# Altium schematic sheet PokerKidtestBoard.SchDoc
size A4
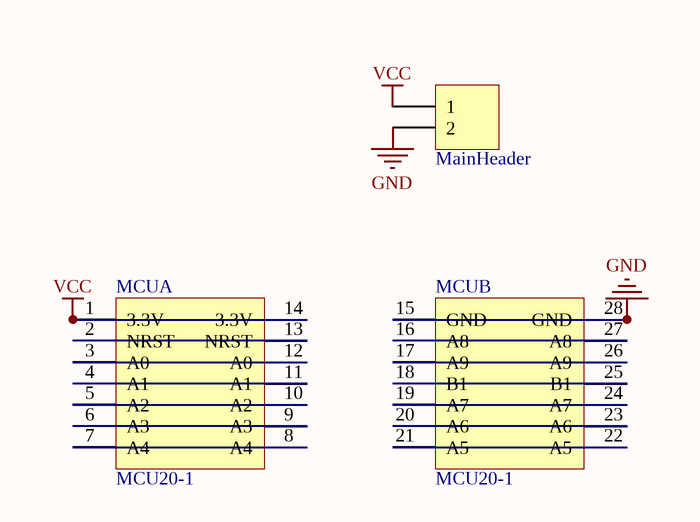
[diagram p0: PokerKidtestBoard.SchDoc]

## Parts
MainHeader  691312510002  [691312510002]  (value not drawn)
MCU  MCU20-1  [MCU20-1]  (parts A,B of 2)

## Nets
GND: MainHeader.2 MCU.15(GND) MCU.28(GND)
VCC: MainHeader.1 MCU.1(3.3V) MCU.14(3.3V)
NetMCU_2: MCU.2(NRST) MCU.13(NRST)
NetMCU_3: MCU.3(A0) MCU.12(A0)
NetMCU_4: MCU.4(A1) MCU.11(A1)
NetMCU_5: MCU.5(A2) MCU.10(A2)
NetMCU_6: MCU.6(A3) MCU.9(A3)
NetMCU_7: MCU.7(A4) MCU.8(A4)
NetMCU_16: MCU.16(A8) MCU.27(A8)
NetMCU_17: MCU.17(A9) MCU.26(A9)
NetMCU_18: MCU.18(B1) MCU.25(B1)
NetMCU_19: MCU.19(A7) MCU.24(A7)
NetMCU_20: MCU.20(A6) MCU.23(A6)
NetMCU_21: MCU.21(A5) MCU.22(A5)

## Library data of the parts
MainHeader = 691312510002: WR-TBL Terminal Blocks Serie 312 – 5.08 mm; Manufacturer: Würth Elektronik eiSos GmbH; ComponentLink1 Description: Manufacturer; ComponentLink2 Description: Datasheet; NoPins: 02; Created Date: 31 March 2014; partNo: 691312510002; ComponentLink1URL: http://www.we-online.com; ComponentLink2URL: http://katalog.we-online.de/em/datasheet/6913125100xx.pdf; Created by: Karrer Zheng